# EAGLE design p2gp2-001 (EAGLE 9.6.2)
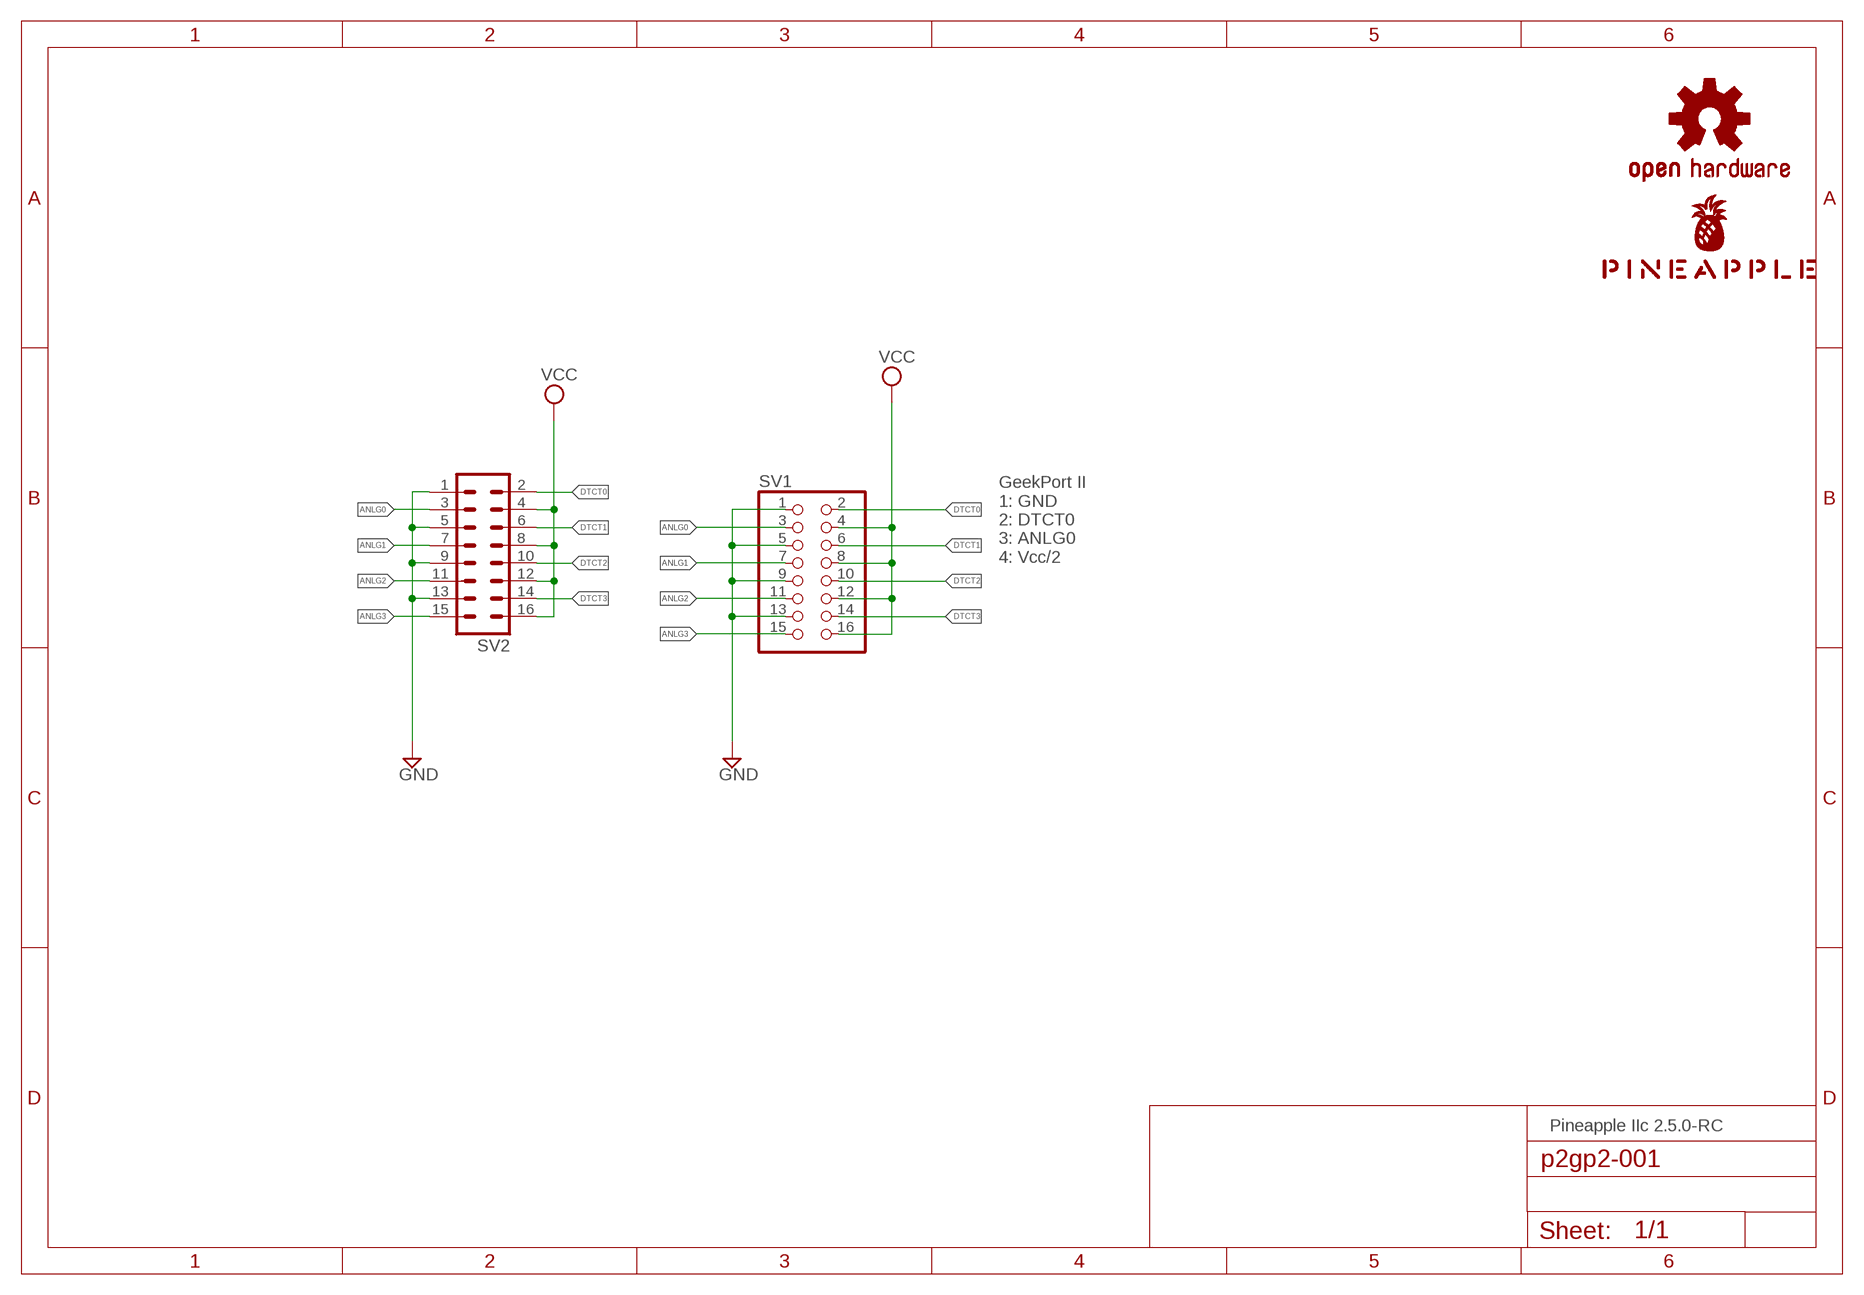
[diagram p0: schematic, sheet 1]

## Parts
LOGO1  OSHW-LOGOS-COPPER  [OSHW-LOGO-S_COPPER]
SV1  PINHD-2X8  [2X08]
SV2  ML16  [ML16]
U$1  PINEAPPLE450_SILK  [PINEAPPLE450_SILK]

## Nets
ANLG0: SV1.3 SV2.3
ANLG1: SV1.7 SV2.7
ANLG2: SV1.11 SV2.11
ANLG3: SV1.15 SV2.15
DTCT0: SV1.2 SV2.2
DTCT1: SV1.6 SV2.6
DTCT2: SV1.10 SV2.10
DTCT3: SV1.14 SV2.14
GND: SV1.1 SV1.5 SV1.9 SV1.13 SV2.1 SV2.5 SV2.9 SV2.13
VCC: SV1.4 SV1.8 SV1.12 SV1.16 SV2.4 SV2.8 SV2.12 SV2.16

## Notes on the sheet
- GeekPort II
  1: GND
  2: DTCT0
  3: ANLG0
  4: Vcc/2
- Pineapple IIc 2.5.0-RC

## Library data of the parts
LOGO1 = SparkFun-Aesthetics:OSHW-LOGO: Open-Source Hardware (OSHW) Logo This logo indicates the piece of hardware it is found on incorporates a OSHW license and/or adheres to the definition of open source hardware found here: http://freedomdefined.org/OSHW
SV1 = pinhead:PINHD-2X8: PIN HEADER
SV2 = con-ml:ML16: HARTING; OC_FARNELL: unknown; OC_NEWARK: unknown
U$1 = pineapple:PINEAPPLE450_SILK

## Net classes
0 default: width 0.152 mm, drill 0.152 mm, clearance 0.152 mm
1 ground: width 0.305 mm, drill 0.152 mm, clearance 0.152 mm
2 power1: width 0.508 mm, drill 0.152 mm, clearance 0.152 mm
3 power2: width 0.61 mm, drill 0.152 mm, clearance 0.152 mm
4 analog: width 0.305 mm, drill 0.152 mm, clearance 0.152 mm
5 external: width 0.152 mm, drill 0.152 mm, clearance 0.152 mm

## Board
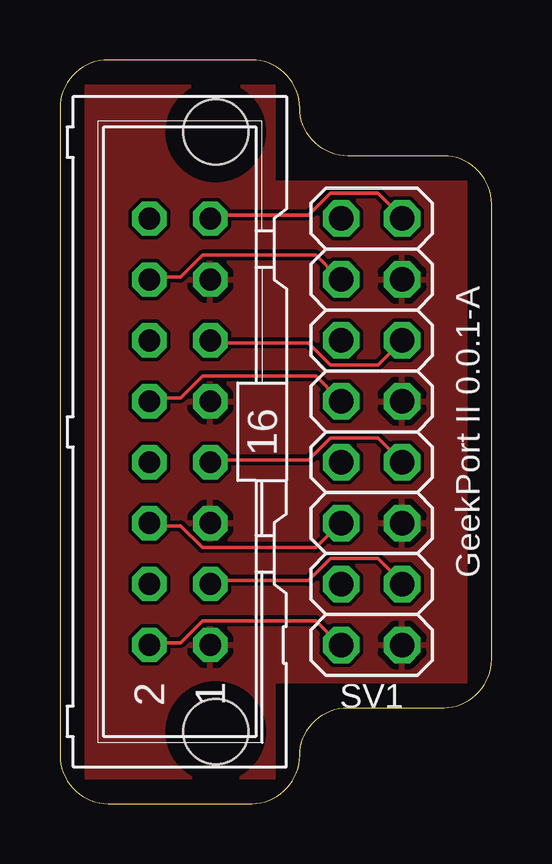
[diagram p1: board, top side]
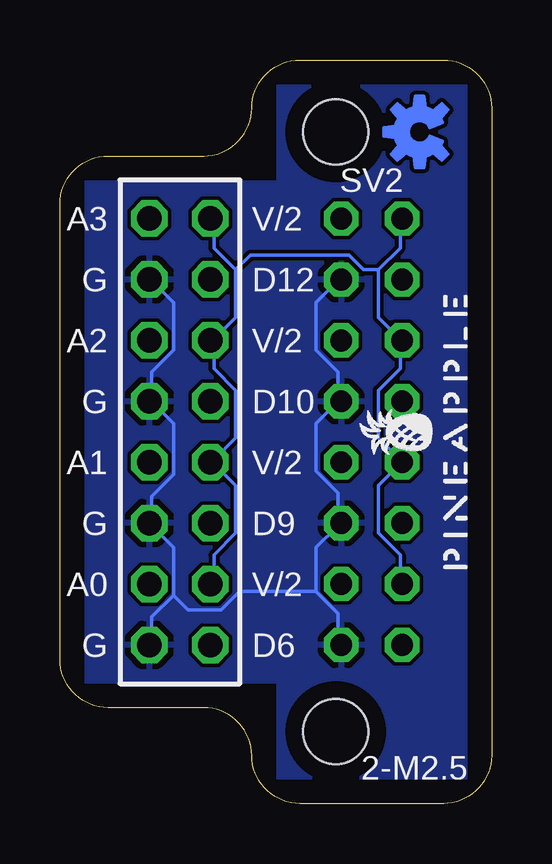
[diagram p2: board, bottom side, seen from below]

Size 18 x 31 mm. Coordinates in mm from the lower left corner, seen from the top.
Outline: 0,29 0,2 arc90 2,0 8,0 arc90 10,2 arc-90 12,4 16,4 arc90 18,6 18,25 arc90 16,27 12,27 arc-90 10,29 arc90 8,31 2,31 arc90 0,29
Copper layers (1*16): Top 0.035mm / dielectric 1.5mm / Bottom 0.035mm
Design rules "SeeedStudio_2layer_DRU_no_angle_20140221": minimum track width 6mil, minimum drill 12mil, track to track 6mil, track to pad 6mil, pad to pad 6mil, via to via 6mil, smd to smd 0mil, copper to edge 10mil, drill to drill 10mil, minimum pad ring 10mil, minimum via ring 6mil, stop-mask expansion 2mil, vias tented up to drill 100mil, thermal gap 10mil
Holes 2.7 mm at 6.5,3 6.5,28
tRestrict: area 4.5,1 to 8.5,5; area 4.5,26 to 8.5,30; area 0,0 to 1,31; area 0,30 to 10,31; area 9,26 to 10,31; area 9,26 to 18,27; area 17,4 to 18,27; area 9,4 to 18,5; area 9,0 to 10,5; area 0,0 to 10,1
bRestrict: area 0,0 to 10,1; area 17,4 to 18,27; area 0,30 to 10,31; area 0,0 to 1,31; area 4.5,1 to 8.5,5; area 4.5,26 to 8.5,30; area 9,26 to 18,27; area 9,4 to 18,5; area 9,0 to 10,5; area 9,26 to 10,31

### Footprints (pad centres in the part's own frame; a part is rotated, then mirrored left to right if it is on the bottom)
2X08 = drill 1.016 octagon: 1 -8.89,-1.27; 2 -8.89,1.27; 3 -6.35,-1.27; 4 -6.35,1.27; 5 -3.81,-1.27; 6 -3.81,1.27; 7 -1.27,-1.27; 8 -1.27,1.27; 9 1.27,-1.27; 10 1.27,1.27; 11 3.81,-1.27; 12 3.81,1.27; 13 6.35,-1.27; 14 6.35,1.27; 15 8.89,-1.27; 16 8.89,1.27
ML16 = drill 0.914 octagon: 1 -8.89,-1.27; 2 -8.89,1.27; 3 -6.35,-1.27; 4 -6.35,1.27; 5 -3.81,-1.27; 6 -3.81,1.27; 7 -1.27,-1.27; 8 -1.27,1.27; 9 1.27,-1.27; 10 1.27,1.27; 11 3.81,-1.27; 12 3.81,1.27; 13 6.35,-1.27; 14 6.35,1.27; 15 8.89,-1.27; 16 8.89,1.27

### Placement (x,y rotation side)
LOGO1  3,28 90 bottom
SV1  13,15.5 90 top
SV2  5,15.5 90 top
U$1  1,15.5 90 bottom

### Tracks (layer width: path | path; a pad name or v marks a point on that pad's centre or on a via)
ANLG0
  Top 0.152: SV2.3 6.4,9.3 10.36,9.3 11.28,10.21 13.26,10.21 14.17,9.3 SV1.3
ANLG1
  Top 0.152: SV2.7 6.4,14.33 10.36,14.33 11.28,15.24 13.26,15.24 14.17,14.33 SV1.7
ANLG2
  Top 0.152: SV2.11 6.4,19.2 10.36,19.2 11.28,18.29 13.26,18.29 14.17,19.2 SV1.11
ANLG3
  Top 0.152: SV2.15 6.4,24.54 10.36,24.54 11.28,25.45 13.26,25.45 14.17,24.54 SV1.15
DTCT0
  Top 0.152: SV2.2 3.81,6.71 5.03,6.71 5.94,7.62 10.67,7.62 11.58,6.71 SV1.2
DTCT1
  Top 0.152: SV2.6 3.81,11.58 5.03,11.58 5.94,10.67 10.67,10.67 11.58,11.58 SV1.6
DTCT2
  Top 0.152: SV2.10 3.81,16.92 5.03,16.92 5.94,17.83 10.67,17.83 11.58,16.92 SV1.10
DTCT3
  Top 0.152: SV2.14 3.81,21.95 5.03,21.95 5.94,22.86 10.67,22.86 11.58,21.95 SV1.14
GND
  Bottom 0.152: 7.32,8.84 6.4,7.92 6.4,6.71 SV2.1 | 7.32,8.84 7.32,10.67 6.4,11.58 SV2.5 6.4,11.73 6.4,12.95 7.32,13.87 7.32,15.85 6.4,16.76 SV2.9 6.4,16.92 6.4,17.98 7.32,18.9 7.32,20.88 6.4,21.79 SV2.13 | 13.26,8.69 14.17,7.77 14.17,6.71 SV1.1 | 13.26,8.69 13.26,10.67 14.17,11.58 SV1.5 14.17,11.73 14.17,12.8 13.26,13.72 13.26,15.85 14.17,16.76 SV1.9 14.17,16.92 14.17,17.98 13.26,18.9 13.26,20.88 14.17,21.79 SV1.13 | 7.32,8.84 10.52,8.84 11.28,8.08 12.65,8.08 13.26,8.69
  pour Top: -1,-1 19,-1 19,32 -1,32
  pour Bottom: -2,-2 20,-2 20,33 -2,33
VCC
  Bottom 0.152: SV2.4 3.81,9.3 3.81,10.36 4.72,11.28 4.72,13.26 3.81,14.17 SV2.8 3.81,14.33 4.72,15.24 4.72,17.22 3.81,18.14 3.81,19.2 SV2.12 3.81,19.36 4.72,20.27 4.72,22.25 | 4.72,22.25 3.81,23.16 3.81,24.38 SV2.16 | SV1.4 11.58,9.3 11.58,10.36 10.67,11.28 10.67,13.26 11.58,14.17 SV1.8 11.58,14.33 10.67,15.24 10.67,17.22 11.58,18.14 11.58,19.2 SV1.12 11.58,19.36 10.67,20.27 10.67,22.25 | 10.67,22.25 11.58,23.16 11.58,24.38 SV1.16 | 4.72,22.25 5.33,22.25 5.94,22.86 10.06,22.86 10.67,22.25

### Text on the board
tNames: GeekPort II 0.0.1-A
bNames: V/2 | A3 | D12 | G | V/2 | A2 | D10 | G | V/2 | A1 | D9 | G | V/2 | A0 | D6 | G | 2-M2.5